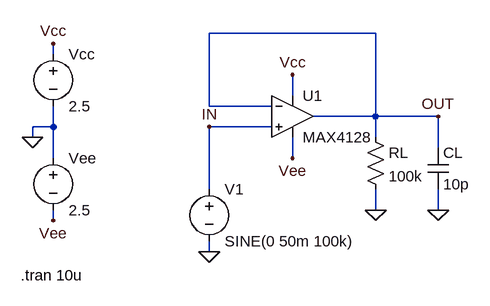
[diagram p0: schematic MAX4128.asc]
MAX4128.asc, the LTspice schematic file:
Version 4
SHEET 1 1720 800
WIRE 560 256 304 256
WIRE 64 288 64 272
WIRE 432 352 432 320
WIRE 304 368 304 256
WIRE 400 368 304 368
WIRE 560 384 560 256
WIRE 560 384 464 384
WIRE 656 384 560 384
WIRE 64 400 64 368
WIRE 64 400 32 400
WIRE 400 400 304 400
WIRE 32 416 32 400
WIRE 560 416 560 384
WIRE 656 432 656 384
WIRE 64 448 64 400
WIRE 432 448 432 416
WIRE 304 496 304 400
WIRE 560 528 560 496
WIRE 656 528 656 496
WIRE 64 544 64 528
WIRE 304 592 304 576
FLAG 656 384 OUT
FLAG 64 272 Vcc
FLAG 64 544 Vee
FLAG 432 320 Vcc
FLAG 432 448 Vee
FLAG 32 416 0
FLAG 304 592 0
FLAG 560 528 0
FLAG 304 400 IN
FLAG 656 528 0
SYMBOL voltage 64 432 R0
WINDOW 123 0 0 Left 2
SYMATTR InstName Vee
SYMATTR Value 2.5
SYMBOL voltage 64 272 R0
WINDOW 123 0 0 Left 2
SYMATTR InstName Vcc
SYMATTR Value 2.5
SYMBOL res 544 400 R0
SYMATTR InstName RL
SYMATTR Value 100k
SYMBOL voltage 304 480 R0
WINDOW 123 0 0 Left 0
WINDOW 39 0 0 Left 0
SYMATTR InstName V1
SYMATTR Value SINE(0 50m 100k)
SYMBOL cap 640 432 R0
SYMATTR InstName CL
SYMATTR Value 10p
SYMBOL MAX4128 432 320 R0
SYMATTR InstName U1
TEXT 14 628 Left 2 !.tran 10u

The netlist it stands for:
* MAX4128.asc
Vee 0 Vee 2.5
Vcc Vcc 0 2.5
RL OUT 0 100k
V1 IN 0 SINE(0 50m 100k)
CL OUT 0 10p
* U1: MAX4128 (symbol MAX4128 not available, pins judged from their places): In+=IN In-=OUT V+=Vcc V-=Vee OUT=OUT
.tran 10u
.backanno
.end